# Altium schematic sheet Sheet1.SchDoc
size A4
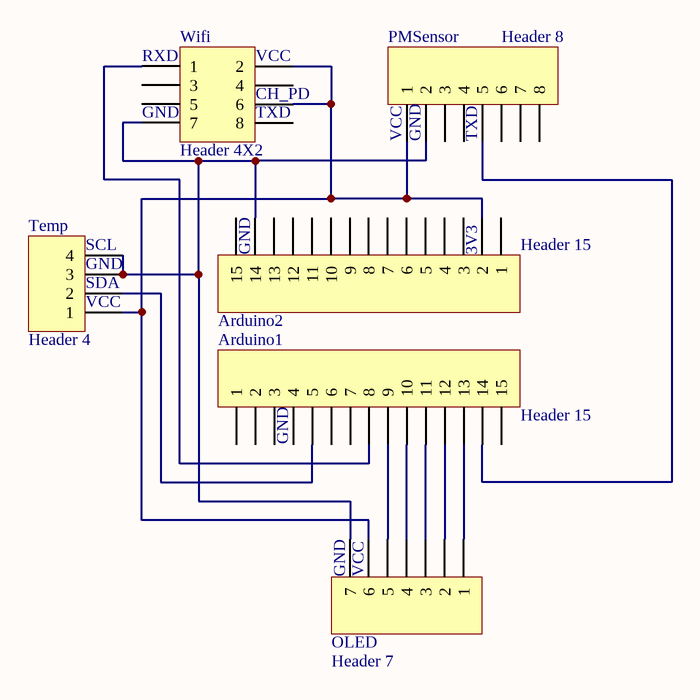
[diagram p0: Sheet1.SchDoc]

## Parts
Arduino1  Header 15  [HDR1X15]
Arduino2  Header 15  [HDR1X15]
OLED  Header 7  [HDR1X7]
PMSensor  Header 8  [HDR1X8]
Temp  Header 4  [HDR1X4]
Wifi  Header 4X2  [HDR2X4]

## Nets
NetArduino1_5: Arduino1.5 Temp.2
NetArduino1_8: Arduino1.8 Wifi.1
NetArduino1_9: Arduino1.9 OLED.5
NetArduino1_10: Arduino1.10 OLED.4
NetArduino1_11: Arduino1.11 OLED.3
NetArduino1_12: Arduino1.12 OLED.2
NetArduino1_13: Arduino1.13 OLED.1
NetArduino1_14: Arduino1.14 PMSensor.5
NetArduino2_2: Arduino2.2 OLED.6 PMSensor.1 Temp.1 Wifi.2 Wifi.6
NetArduino2_14: Arduino2.14 OLED.7 PMSensor.2 Temp.3 Temp.4 Wifi.7

Not connected (* = marked no-connect by the designer): Arduino1 1 2 3 4 6 7 15; Arduino2 1 3 4 5 6 7 8 9 10 11 12 13 15; PMSensor 3 4 6 7 8; Wifi 3 4 5 8

## Notes on the sheet
- (near Wifi) RXD
- (near Wifi) VCC
- (near Wifi) CH_PD
- (near Wifi) GND
- (near Wifi) TXD
- (near PMSensor) VCC
- (near PMSensor) GND
- (near PMSensor) TXD
- (near Temp) SDA
- (near Temp) GND
- (near Temp) SCL
- (near Arduino2) GND
- (near Arduino2) 3V3
- (near Temp) VCC
- (near Arduino1) GND
- (near OLED) GND
- (near OLED) VCC

## Library data of the parts
Arduino1 Arduino2 = Header 15: Header, 15-Pin; LatestRevisionDate: 17-Jul-2002; LatestRevisionNote: Re-released for DXP Platform.; Publisher: Altium Limited
OLED = Header 7: Header, 7-Pin; LatestRevisionDate: 17-Jul-2002; LatestRevisionNote: Re-released for DXP Platform.; Publisher: Altium Limited
PMSensor = Header 8: Header, 8-Pin; LatestRevisionDate: 17-Jul-2002; LatestRevisionNote: Re-released for DXP Platform.; Publisher: Altium Limited
Temp = Header 4: Header, 4-Pin; LatestRevisionDate: 17-Jul-2002; LatestRevisionNote: Re-released for DXP Platform.; Publisher: Altium Limited
Wifi = Header 4X2: Header, 4-Pin, Dual row; LatestRevisionDate: 17-Jul-2002; LatestRevisionNote: Re-released for DXP Platform.; Publisher: Altium Limited